# EAGLE design EM4100_cloner-revB (EAGLE 6.5.0)
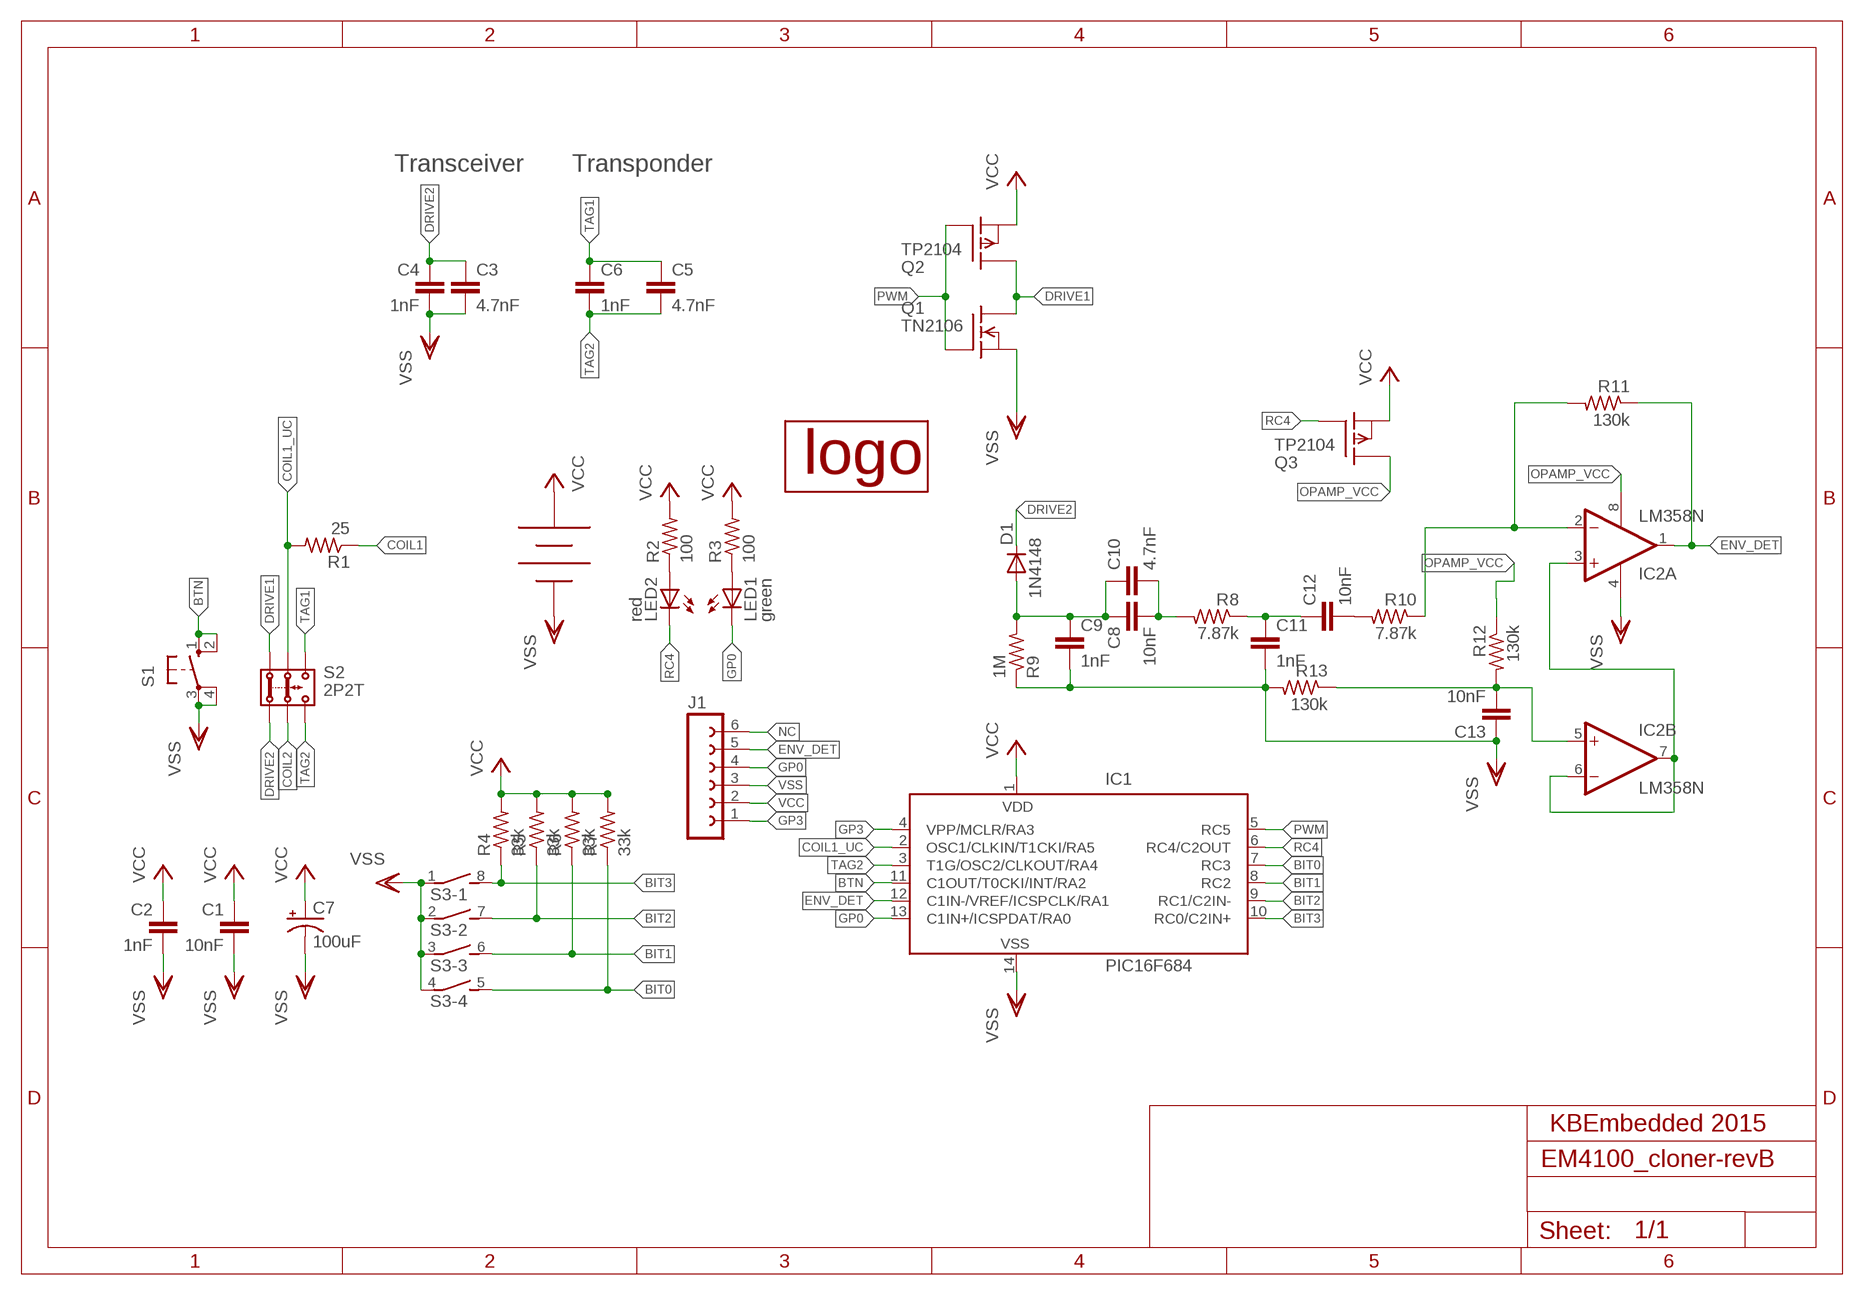
[diagram p0: schematic, sheet 1]

## Parts
BT1  BAT-HLD-001-THM  [BAT-HLD-001-THM]
C1  10nF  C-EU050-024X044  [C050-024X044]
C2  1nF  C-EU050-024X044  [C050-024X044]
C3  4.7nF  C-EU050-024X044  [C050-024X044]
C4  1nF  C-EU050-024X044  [C050-024X044]
C5  4.7nF  C-EU050-024X044  [C050-024X044]
C6  1nF  C-EU050-024X044  [C050-024X044]
C7  100uF  CPOL-USE2,5-6E  [E2,5-6E]
C8  10nF  C-EU050-024X044  [C050-024X044]
C9  1nF  C-EU050-024X044  [C050-024X044]
C10  4.7nF  C-EU050-024X044  [C050-024X044]
C11  1nF  C-EU050-024X044  [C050-024X044]
C12  10nF  C-EU050-024X044  [C050-024X044]
C13  10nF  C-EU050-024X044  [C050-024X044]
D1  1N4148  DIODE-D-5  [D-5]
IC1  PIC16F684  PIC16F636P  [DIL14]
IC2  LM358N  [DIL08]
J1  FE06-1  [FE06]
LED1  green  LED3MM  [LED3MM]
LED2  red  LED3MM  [LED3MM]
Q1  TN2106  TN0602N3  [TO-92]
Q2  TP2104  TP0602N3  [TO-92]
Q3  TP2104  TP0602N3  [TO-92]
R1  25  R-US_0204/7  [0204/7]
R2  100  R-US_0204/7  [0204/7]
R3  100  R-US_0204/7  [0204/7]
R4  33k  R-US_0204/7  [0204/7]
R5  33k  R-US_0204/7  [0204/7]
R6  33k  R-US_0204/7  [0204/7]
R7  33k  R-US_0204/7  [0204/7]
R8  7.87k  R-US_0204/7  [0204/7]
R9  1M  R-US_0204/7  [0204/7]
R10  7.87k  R-US_0204/7  [0204/7]
R11  130k  R-US_0204/7  [0204/7]
R12  130k  R-US_0204/7  [0204/7]
R13  130k  R-US_0204/7  [0204/7]
S1  10-XX  [B3F-10XX]
S2  2P2T  [2P2T]
S3  DIP04S  [DIP04S]
U$1  KBELOGO-SILK  [KBELOGO-SILK]

## Nets
BIT0: IC1.7(RC3) R7.1 S3.5
BIT1: IC1.8(RC2) R6.1 S3.6
BIT2: IC1.9(RC1/C2IN-) R5.1 S3.7
BIT3: IC1.10(RC0/C2IN+) R4.1 S3.8
BTN: IC1.11(C1OUT/T0CKI/INT/RA2) S1.1(S) S1.2(S1)
COIL1: R1.1
COIL1_UC: IC1.2(OSC1/CLKIN/T1CKI/RA5) R1.2 S2.2.1
COIL2: S2.2.2
DRIVE1: Q1.3(D) Q2.3(D) S2.1.1
DRIVE2: C3.1 C4.1 D1.C S2.1.2
ENV_DET: IC1.12(C1IN-/VREF/ICSPCLK/RA1) IC2.1(A:OUT) J1.5 R11.1
GP0: IC1.13(C1IN+/ICSPDAT/RA0) J1.4 LED1.K(C)
GP3: IC1.4(VPP/MCLR/RA3) J1.1
N$1: LED2.A R2.1
N$2: LED1.A R3.1
N$3: C8.1 C9.1 C10.1 D1.A R9.2
N$5: C8.2 C10.2 R8.2
N$6: C11.1 C12.1 R8.1
N$7: C12.2 R10.2
N$8: IC2.3(A:+IN) IC2.6(B:-IN) IC2.7(B:OUT)
N$9: C13.2 IC2.5(B:+IN) R12.2 R13.1
N$10: IC2.2(A:-IN) R10.1 R11.2
NC: J1.6
OPAMP_VCC: IC2.8(P:V+) Q3.3(D) R12.1
PWM: IC1.5(RC5) Q1.2(G) Q2.2(G)
RC4: IC1.6(RC4/C2OUT) LED2.K(C) Q3.2(G)
TAG1: C5.1 C6.1 S2.3.1
TAG2: C5.2 C6.2 IC1.3(T1G/OSC2/CLKOUT/RA4) S2.3.2
VCC: BT1.+@0(VCC) BT1.+@1(VCC) BT1.+@2(VCC) BT1.+@3(VCC) C1.1 C2.1 C7.+ IC1.1(VDD) J1.2 Q2.1(S) Q3.1(S) R2.2 R3.2 R4.2 R5.2 R6.2 R7.2
VSS: BT1.-(VSS) C1.2 C2.2 C3.2 C4.2 C7.- C9.2 C11.2 C13.1 IC1.14(VSS) IC2.4(P:V-) J1.3 Q1.1(S) R9.1 R13.2 S1.3(P) S1.4(P1) S3.1 S3.2 S3.3 S3.4

## Notes on the sheet
- Transceiver | Transponder
- KBEmbedded 2015

## Library data of the parts
BT1 = cuslibrary:BAT-HLD-001-THM
C1-C6 C8-C13 = rcl:C-EU: CAPACITOR, European symbol
C7 = rcl:CPOL-US: POLARIZED CAPACITOR, American symbol
D1 = diode:DIODE-: DIODE
IC1 = cuslibrary:PIC16F636: 14-Pin, Flash-Based 8-Bit CMOS Microcontroller High Performance RISC CPU: * Only 35 instructions to learn - All single-cycle instructions except branches * Operating speed: - DC - 20 MHz oscillator/clock input - DC - 200 ns instruction cycle * Internal and external oscillator options - Precision Internal 4 MHz oscillator factory calibrated to ±1% - External Oscillator support for crystals and resonators - 5?s wake-up from SLEEP, 3.0V, typical * Power saving SLEEP mode * Wide operating voltage range - 2.0V to 5.5V * Industrial and Extended temperature range * Low power Power-on Reset (POR) * Power-up Timer (PWRT) and Oscillator Start-up Timer (OST) * Brown-out Detect (BOD) * Watchdog Timer (WDT) with independent oscillator for reliable operation * Multiplexed MCLR/Input-pin * Interrupt-on-pin change * Individual programmable weak pull-ups * Programmable code protection * High Endurance FLASH/EEPROM Cell - 100,000 write FLASH endurance - 1,000,000 write EEPROM endurance - FLASH/Data EEPROM Retention: > 40 years * Standby Current: - 1 nA @ 2.0V, typical * Operating Current: - 8.5?A @ 32 kHz, 2.0V, typical - 100?A @ 1 MHz, 2.0V, typical * Watchdog Timer Current - 300 nA @ 2.0V, typical * Timer1 oscillator current: - 4?A @ 32 kHz, 2.0V, typical * 12 I/O pins with individual direction control * High current sink/source for direct LED drive * Analog-to-Digital Converter module (PIC16F676): - 10-bit resolution - Programmable 8-channel input - Voltage reference input * In-Circuit Serial ProgrammingTM (ICSPTM) via two pins Source: http://ww1.microchip.com/downloads/en/DeviceDoc/40039E.pdf; MF: MICROCHIP; MPN: PIC16F636-I/P
IC2 = linear:LM358: OP AMP also LM158; LM258; LM2904 Source: http://cache.national.com/ds/LM/LM158.pdf
J1 = con-lsta:FE06-1: FEMALE HEADER; OC_FARNELL: unknown; OC_NEWARK: unknown
LED1 LED2 = led:LED: LED OSRAM: - CHIPLED LG R971, LG N971, LY N971, LG Q971, LY Q971, LO R971, LY R971 LH N974, LH R974 LS Q976, LO Q976, LY Q976 LO Q996 - Hyper CHIPLED LW Q18S LB Q993, LB Q99A, LB R99A - SideLED LS A670, LO A670, LY A670, LG A670, LP A670 LB A673, LV A673, LT A673, LW A673 LH A674 LY A675 LS A676, LA A676, LO A676, LY A676, LW A676 LS A679, LY A679, LG A679 - Hyper Micro SIDELED® LS Y876, LA Y876, LO Y876, LY Y876 LT Y87S - SmartLED LW L88C, LW L88S LB L89C, LB L89S, LG L890 LS L89K, LO L89K, LY L89K LS L896, LA L896, LO L896, LY L896 - TOPLED LS T670, LO T670, LY T670, LG T670, LP T670 LSG T670, LSP T670, LSY T670, LOP T670, LYG T670 LG T671, LOG T671, LSG T671 LB T673, LV T673, LT T673, LW T673 LH T674 LS T676, LA T676, LO T676, LY T676, LB T676, LH T676, LSB T676, LW T676 LB T67C, LV T67C, LT T67C, LS T67K, LO T67K, LY T67K, LW E67C LS E67B, LA E67B, LO E67B, LY E67B, LB E67C, LV E67C, LT E67C LW T67C LS T679, LY T679, LG T679 LS T770, LO T770, LY T770, LG T770, LP T770 LB T773, LV T773, LT T773, LW T773 LH T774 LS E675, LA E675, LY E675, LS T675 LS T776, LA T776, LO T776, LY T776, LB T776 LHGB T686 LT T68C, LB T68C - Hyper Mini TOPLED® LB M676 - Mini TOPLED Santana® LG M470 LS M47K, LO M47K, LY M47K Source: http://www.osram.convergy.de LUXEON: - LUMILED® LXK2-PW12-R00, LXK2-PW12-S00, LXK2-PW14-U00, LXK2-PW14-V00 LXK2-PM12-R00, LXK2-PM12-S00, LXK2-PM14-U00 LXK2-PE12-Q00, LXK2-PE12-R00, LXK2-PE12-S00, LXK2-PE14-T00, LXK2-PE14-U00 LXK2-PB12-K00, LXK2-PB12-L00, LXK2-PB12-M00, LXK2-PB14-N00, LXK2-PB14-P00, LXK2-PB14-Q00 LXK2-PR12-L00, LXK2-PR12-M00, LXK2-PR14-Q00, LXK2-PR14-R00 LXK2-PD12-Q00, LXK2-PD12-R00, LXK2-PD12-S00 LXK2-PH12-R00, LXK2-PH12-S00 LXK2-PL12-P00, LXK2-PL12-Q00, LXK2-PL12-R00 Source: www.luxeon.com KINGBRIGHT: KA-3528ASYC Source: www.kingbright.com
Q1 = transistor-fet:TN0602N3: N-Channel Enhancement MOSFET 20V; 4A; 0,75Ohm
Q2 Q3 = transistor-fet:TP0602N3: P-Channel Enhancement MOSFET -20V; -2A; 2,0Ohm
R1-R13 = rcl:R-US_: RESISTOR, American symbol
S1 = switch-omron:10-XX: OMRON SWITCH; MPN: B3F-1000; OC_FARNELL: 176432; OC_NEWARK: 36M3542
S2 = cuslibrary:2P2T: SLIDE SWITCH 2P2T Part No. SS-22F05-G(A)4 Source: CANAL ELECTRONIC CO., LTD .. switsch.pdf
S3 = switch-dil:DIP04S: DIL/CODE SWITCH; OC_FARNELL: unknown; OC_NEWARK: unknown
U$1 = cuslibrary:KBELOGO-SILK

## Board
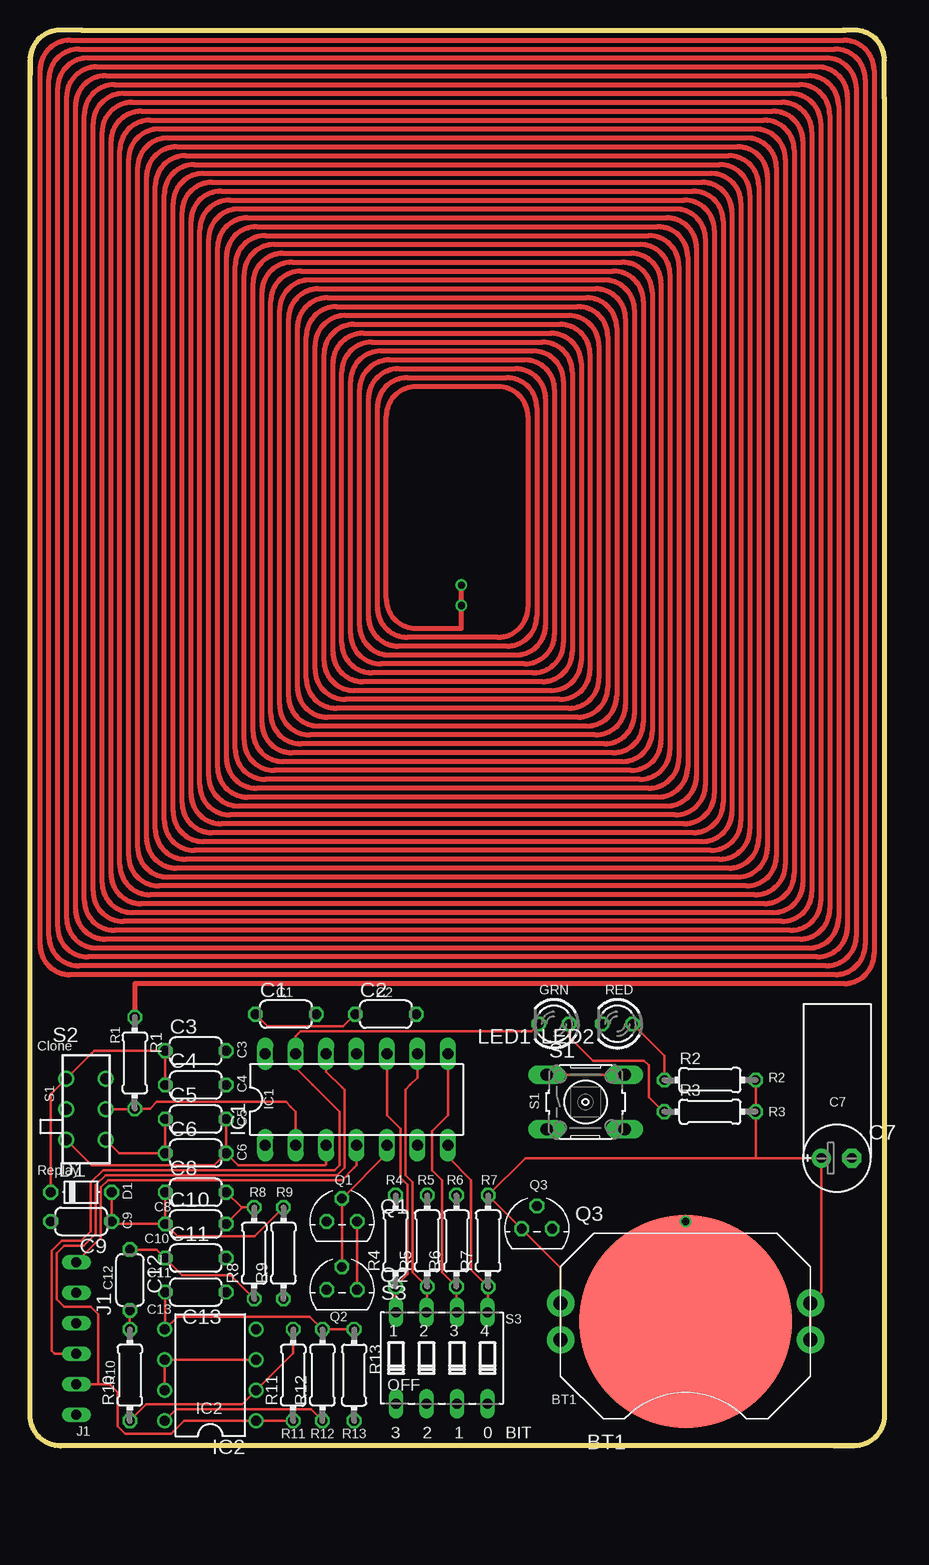
[diagram p1: board, top side]
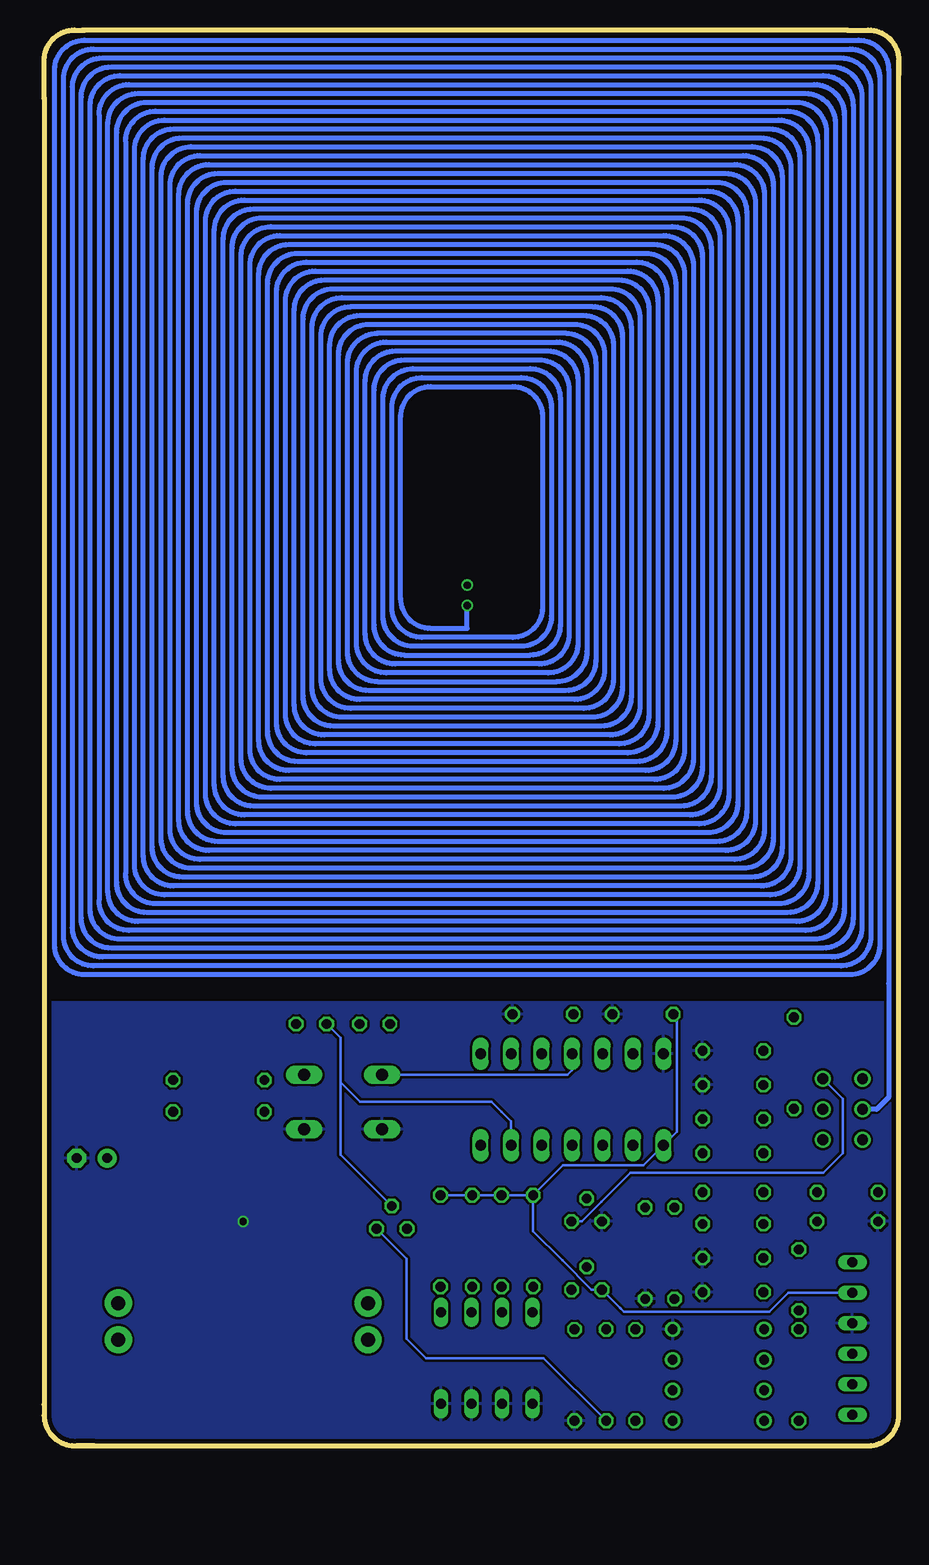
[diagram p2: board, bottom side, seen from below]

Size 71.25 x 117.98 mm. Coordinates in mm from the lower left corner, seen from the top.
Outline: 68.71,0 68.58,0
Outline: 68.58,0 67.06,0
Outline: 67.06,0 2.54,0 arc-90 0,2.54
Outline: 0,2.41 0,114.2
Outline: 0,114.2 0,115.19
Outline: 0,115.19 0,115.44
Outline: 4.27,117.98 4.32,117.98
Outline: 4.32,117.98 67.82,117.98
Outline: 67.82,117.98 68.07,117.98
Outline: 71.25,112.37 71.25,112.27
Outline: 71.25,112.27 71.25,3.45
Outline: 0,115.32 0,115.19
Outline: 0,115.19 0,114.2
Outline: 67.06,0 68.58,0
Outline: 71.25,3.43 71.25,2.54 arc-90 68.71,0
Outline: 68.71,0 68.58,0
Outline: 71.25,112.27 71.25,115.44 arc90 68.71,117.98 67.82,117.98
Outline: 4.32,117.98 2.54,117.98 arc90 0,115.44
Outline: 0,115.44 0,115.19
Copper layers (1*16): Top 0.0356mm / dielectric 1.5011mm / Bottom 0.0356mm
Design rules "RIFD": minimum track width 6mil, minimum drill 13mil, track to track 8mil, track to pad 8mil, pad to pad 8mil, via to via 8mil, smd to smd 8mil, copper to edge 15mil, drill to drill 6mil, minimum pad ring 7mil, minimum via ring 7mil, stop-mask expansion 3mil, vias tented up to drill 0mil, thermal gap 10mil

### Footprints (pad centres in the part's own frame; a part is rotated, then mirrored left to right if it is on the bottom)
BAT-HLD-001-THM = drill 1.168 pad 2.286: +@0 -10.414,1.524; +@1 -10.414,-1.524; +@2 10.414,1.524; +@3 10.414,-1.524 | smd 17.78 x 17.78: - 0,0
C050-024X044 = drill 0.813 octagon: 1 -2.54,0; 2 2.54,0
E2,5-6E = drill 0.813 pad 1.575: + -1.27,0 | drill 0.813 pad 1.575 octagon: - 1.27,0
D-5 = drill 0.813 octagon: A 2.54,0; C -2.54,0
DIL14 = drill 0.9 long: 1 -7.62,-3.81; 2 -5.08,-3.81; 3 -2.54,-3.81; 4 0,-3.81; 5 2.54,-3.81; 6 5.08,-3.81; 7 7.62,-3.81; 8 7.62,3.81; 9 5.08,3.81; 10 2.54,3.81; 11 0,3.81; 12 -2.54,3.81; 13 -5.08,3.81; 14 -7.62,3.81
DIL08 = drill 0.813 pad 1.27: 1 -3.81,-3.81; 2 -1.27,-3.81; 3 1.27,-3.81; 4 3.81,-3.81; 5 3.81,3.81; 6 1.27,3.81; 7 -1.27,3.81; 8 -3.81,3.81
FE06 = drill 0.813 long: 1 -6.35,0; 2 -3.81,0; 3 -1.27,0; 4 1.27,0; 5 3.81,0; 6 6.35,0
LED3MM = drill 0.813 octagon: A -1.27,0; K 1.27,0
TO-92 = drill 0.813 octagon: 1 -1.27,0; 2 0,1.905; 3 1.27,0
0204/7 = drill 0.813 octagon: 1 -3.81,0; 2 3.81,0
B3F-10XX = drill 1.016 long: 1 -3.251,2.261; 2 3.251,2.261; 3 -3.251,-2.261; 4 3.251,-2.261
2P2T = drill 0.9: 1.1 -2.54,1.651; 1.2 -2.54,-1.651; 2.1 0,1.651; 2.2 0,-1.651; 3.1 2.54,1.651; 3.2 2.54,-1.651
DIP04S = drill 0.813 long: 1 -3.81,-3.81; 2 -1.27,-3.81; 3 1.27,-3.81; 4 3.81,-3.81; 5 3.81,3.81; 6 1.27,3.81; 7 -1.27,3.81; 8 -3.81,3.81

### Placement (x,y rotation side)
BT1  54.66,10.36 0 top
C1  21.34,35.97 0 top
C2  29.67,35.97 0 top
C3  13.82,32.92 0 top
C4  13.82,30.07 0 top
C5  13.82,27.23 0 top
C6  13.82,24.38 0 top
C7  67.26,23.98 0 top
C8  13.82,21.13 0 top
C9  4.27,18.69 180 top
C10  13.82,18.49 0 top
C11  13.82,15.65 0 top
C12  8.33,13.82 270 top
C13  13.82,12.8 180 top
D1  4.27,21.13 0 top
IC1  27.23,28.85 0 top
IC2  15.04,5.89 90 top
J1  3.86,8.94 270 top
LED1  43.69,35.15 180 top
LED2  48.97,35.15 180 top
Q1  26.01,18.69 0 top
Q2  26.01,13 0 top
Q3  42.27,18.08 0 top
R1  8.74,31.9 270 top
R2  56.69,30.48 0 top
R3  56.69,27.84 0 top
R4  30.48,17.07 90 top
R5  33.12,17.07 90 top
R6  35.56,17.07 90 top
R7  38.2,17.07 90 top
R8  18.69,16.05 90 top
R9  21.13,16.05 90 top
R10  8.33,5.89 90 top
R11  21.95,5.89 90 top
R12  24.38,5.89 90 top
R13  27.03,5.89 270 top
S1  46.33,28.65 0 top
S2  4.67,28.04 270 top
S3  34.34,7.32 0 top
U$1  31.29,109.12 0 top
U$2  DN_LOGO  [DN_LOGO]  29.39,75.5 0 top

### Tracks (layer width: path | path; a pad name or v marks a point on that pad's centre or on a via)
1_50
  Bottom 0.203: 47.9,97.15 | 24.06,59.23 24.06,59.24 | 52.34,101.59 | 56.78,106.03 | 54.56,103.81 | 50.12,99.37 | 21.84,57.02 | 59,108.25 | 63.44,112.69 | 9.26,44.44 9.26,44.43 | 67.88,117.13 | 4.82,39.99 4.82,40 | 65.66,114.91 | 7.04,42.22 7.04,42.21 | 68.89,43.23 68.9,43.23 | 66.67,45.45 66.68,45.45 | 61.22,110.47 | 64.45,47.67 64.46,47.67 | 51.88,60.26 51.87,60.26 | 49.66,62.48 49.65,62.48 | 45.68,94.93 | 26.28,61.45 26.28,61.46 | 43.46,92.71 | 28.5,63.68 28.5,63.67 | 47.44,64.69 47.43,64.69 | 41.24,90.49 | 30.72,65.89 30.72,65.9 | 45.22,66.92 | 43,69.14 42.99,69.14 | 46.42,95.67 | 22.3,93.17 | 48.64,97.89 | 20.08,95.39 | 14.9,100.58 | 16.38,99.09 | 51.6,100.86 | 17.12,98.36 | 11.94,103.53 | 55.3,104.55 | 13.42,102.05 | 14.16,101.31 | 14.44,49.62 | 17.4,52.58 | 20.36,55.53 | 8.98,106.49 | 59.74,108.99 | 11.2,104.27 | 57.52,106.77 | 5.28,110.19 | 6.02,109.45 | 62.7,111.95 | 3.8,111.67 | 3.06,112.41 | 6.3,41.48 | 8.24,107.23 | 62.98,49.15 | 60.02,52.12 | 23.04,92.44 | 25.54,60.72 | 48.92,63.22 | 44.2,93.45 | 24.52,90.95 | 25.26,90.22 | 27.48,88
  Bottom 0.4: 49.65,62.48 arc-90 47.16,59.97 24.8,59.97 arc-90 22.3,62.48 22.3,93.17 arc-90 24.8,95.67 46.42,95.67 arc-90 48.92,93.17 48.92,63.22 arc-90 46.42,60.72 25.54,60.72 arc-90 23.04,63.22 23.04,92.44 arc-90 25.54,94.93 45.68,94.93 | 51.87,60.26 arc-90 49.38,57.75 22.58,57.75 arc-90 20.08,60.26 20.08,95.39 arc-90 22.58,97.89 48.64,97.89 arc-90 51.14,95.39 51.14,60.99 arc-90 48.64,58.49 23.32,58.49 arc-90 20.82,60.99 20.82,94.66 arc-90 23.32,97.15 47.9,97.15 | 24.06,59.23 47.9,59.23 arc90 50.4,61.73 50.4,94.66 arc90 47.9,97.15 | 49.66,62.48 49.66,93.91 arc90 47.16,96.42 24.06,96.42 arc90 21.56,93.91 21.56,61.73 arc90 24.06,59.24 | 52.34,101.59 18.88,101.59 arc90 16.38,99.09 16.38,56.55 arc90 18.88,54.05 53.08,54.05 arc90 55.58,56.55 55.58,99.83 arc90 53.08,102.33 18.14,102.33 arc90 15.64,99.83 15.64,55.81 arc90 18.14,53.31 53.82,53.31 arc90 56.32,55.81 56.32,100.58 arc90 53.82,103.08 17.4,103.08 arc90 14.9,100.58 14.9,55.07 arc90 17.4,52.58 54.56,52.58 arc90 57.06,55.07 57.06,101.31 arc90 54.56,103.81 | 52.34,101.59 arc-90 54.84,99.09 54.84,57.29 arc-90 52.34,54.8 19.62,54.8 arc-90 17.12,57.29 17.12,98.36 arc-90 19.62,100.86 51.6,100.86 arc-90 54.1,98.36 54.1,58.03 arc-90 51.6,55.53 20.36,55.53 arc-90 17.86,58.03 17.86,97.61 arc-90 20.36,100.11 50.86,100.11 arc-90 53.36,97.61 53.36,58.77 arc-90 50.86,56.27 21.1,56.27 arc-90 18.6,58.77 18.6,96.88 arc-90 21.1,99.37 50.12,99.37 | 56.78,106.03 14.44,106.03 arc90 11.94,103.53 11.94,52.12 arc90 14.44,49.62 57.52,49.62 arc90 60.02,52.12 60.02,104.27 arc90 57.52,106.77 13.7,106.77 arc90 11.2,104.27 11.2,51.37 arc90 13.7,48.87 58.26,48.87 arc90 60.76,51.37 60.76,105.02 arc90 58.26,107.52 12.96,107.52 arc90 10.46,105.02 10.46,50.63 arc90 12.96,48.13 59,48.13 arc90 61.5,50.63 61.5,105.75 arc90 59,108.25
  Bottom 0.4: 56.78,106.03 arc-90 59.28,103.53 59.28,52.85 arc-90 56.78,50.35 15.18,50.35 arc-90 12.68,52.85 12.68,102.8 arc-90 15.18,105.3 56.04,105.3 arc-90 58.54,102.8 58.54,53.59 arc-90 56.04,51.09 15.92,51.09 arc-90 13.42,53.59 13.42,102.05 arc-90 15.92,104.55 55.3,104.55 arc-90 57.8,102.05 57.8,54.34 arc-90 55.3,51.84 16.66,51.84 arc-90 14.16,54.34 14.16,101.31 arc-90 16.66,103.81 54.56,103.81 | 21.84,57.02 50.12,57.02 arc90 52.62,59.51 52.62,96.88 arc90 50.12,99.37 | 51.88,60.26 51.88,96.13 arc90 49.38,98.64 21.84,98.64 arc90 19.34,96.13 19.34,59.51 arc90 21.84,57.02 | 59,108.25 12.22,108.25 arc90 9.72,105.75 9.72,49.9 arc90 12.22,47.4 59.74,47.4 arc90 62.24,49.9 62.24,106.49 arc90 59.74,108.99 11.48,108.99 arc90 8.98,106.49 8.98,49.15 arc90 11.48,46.65 60.48,46.65 arc90 62.98,49.15 62.98,107.23 arc90 60.48,109.73 10.74,109.73 arc90 8.24,107.23 8.24,48.41 arc90 10.74,45.91 61.22,45.91 arc90 63.72,48.41 63.72,107.97 arc90 61.22,110.47 | 63.44,112.69 7.78,112.69 arc90 5.28,110.19 5.28,45.45 arc90 7.78,42.95 64.18,42.95 arc90 66.67,45.45 | 63.44,112.69 arc-90 65.94,110.19 65.94,46.19 arc-90 63.44,43.7 8.52,43.7 arc-90 6.02,46.19 6.02,109.45 arc-90 8.52,111.95 62.7,111.95 arc-90 65.2,109.45 65.2,46.93 arc-90 62.7,44.43 9.26,44.43 | 64.46,47.67 64.46,108.71 arc90 61.96,111.21 9.26,111.21 arc90 6.76,108.71 6.76,46.93 arc90 9.26,44.44 | 68.9,43.23 68.9,113.15 arc90 66.4,115.66 4.82,115.66 arc90 2.32,113.15 2.32,42.49 arc90 4.82,40 | 67.88,117.13 3.34,117.13 arc90 0.84,114.63 | 4.82,39.99 67.14,39.99 arc90 69.64,42.49 69.64,113.89 arc90 67.14,116.39 4.08,116.39 arc90 1.58,113.89 1.58,41.75 arc90 4.08,39.26 67.88,39.26 arc90 70.38,41.75 70.38,114.63 arc90 67.88,117.13
  Bottom 0.4: 7.04,42.21 64.92,42.21 arc90 67.42,44.71 67.42,111.67 arc90 64.92,114.17 6.3,114.17 arc90 3.8,111.67 3.8,43.97 arc90 6.3,41.48 65.66,41.48 arc90 68.16,43.97 68.16,112.41 arc90 65.66,114.91 | 68.89,43.23 arc-90 66.4,40.73 5.56,40.73 arc-90 3.06,43.23 3.06,112.41 arc-90 5.56,114.91 65.66,114.91 | 66.68,45.45 66.68,110.93 arc90 64.18,113.44 7.04,113.44 arc90 4.54,110.93 4.54,44.71 arc90 7.04,42.22 | 61.22,110.47 10,110.47 arc90 7.5,107.97 7.5,47.67 arc90 10,45.17 61.96,45.17 arc90 64.45,47.67 | 26.28,61.45 45.68,61.45 arc90 48.18,63.95 48.18,92.44 arc90 45.68,94.93 | 47.44,64.69 47.44,91.69 arc90 44.94,94.19 26.28,94.19 arc90 23.78,91.69 23.78,63.95 arc90 26.28,61.46 | 47.43,64.69 arc-90 44.94,62.19 27.02,62.19 arc-90 24.52,64.69 24.52,90.95 arc-90 27.02,93.45 44.2,93.45 arc-90 46.7,90.95 46.7,65.44 arc-90 44.2,62.94 27.76,62.94 arc-90 25.26,65.44 25.26,90.22 arc-90 27.76,92.71 43.46,92.71 | 43.46,92.71 arc-90 45.96,90.22 45.96,66.17 arc-90 43.46,63.67 28.5,63.67 | 45.22,66.92 45.22,89.47 arc90 42.72,91.97 28.5,91.97 arc90 26,89.47 26,66.17 arc90 28.5,63.68 | 45.22,66.92 arc-90 42.72,64.41 29.24,64.41 arc-90 26.74,66.92 26.74,88.73 arc-90 29.24,91.23 41.98,91.23 arc-90 44.48,88.73 44.48,67.66 arc-90 41.98,65.16 29.98,65.16 arc-90 27.48,67.66 27.48,88 arc-90 29.98,90.49 41.24,90.49 | 41.24,90.49 arc-90 43.74,88 43.74,68.39 arc-90 41.24,65.89 30.72,65.89 | 43,69.14 43,87.25 arc90 40.5,89.75 30.72,89.75 arc90 28.22,87.25 28.22,68.39 arc90 30.72,65.9 | 39.02,88.27 32.2,88.27 arc90 29.7,85.78 29.7,69.88 arc90 32.2,67.38 39.76,67.38 arc90 42.26,69.88 42.26,86.51 arc90 39.76,89.01 31.46,89.01 arc90 28.96,86.51 28.96,69.14 arc90 31.46,66.63 40.5,66.63 arc90 42.99,69.14
1_57  (via drill 0.6)
  Top 0.4: 39.02,88.27 32.2,88.27 arc90 29.7,85.78 29.7,70.61 arc90 32.2,68.11 35.98,68.11 v35.98,70.02 35.98,71.72
  Bottom 0.4: v35.98,70.02 35.98,68.11 39.02,68.11 arc90 41.52,70.61 41.52,85.78 arc90 39.02,88.27
BIT0
  Top 0.203: S3.5 38.2,11.18 R7.1 36.78,14.68 36.78,22.15 34.85,24.08 IC1.7
BIT1
  Top 0.203: S3.6 35.56,11.18 R6.1 34.34,14.48 34.34,22.15 33.53,22.96 33.53,26.21 34.85,27.53 IC1.8
BIT2
  Top 0.203: S3.7 33.12,11.18 R5.1 31.9,14.48 31.9,21.95 31.29,22.55 31.29,22.76 31.29,29.67 31.7,30.07 32.31,30.68 IC1.9
BIT3
  Top 0.203: S3.8 30.48,11.18 R4.1 31.5,14.28 31.5,21.74 30.89,22.35 30.89,26.42 29.77,27.53 IC1.10
BTN
  Top 0.203: S1.2 S1.1
  Bottom 0.203: S1.1 27.61,30.91 27.23,31.29 IC1.11
COIL1
  Top 0.203: 67.88,117.13 | 61.22,110.47 | 63.44,112.69 | 65.66,114.91 | 59,108.25 | 50.12,99.37 | 52.34,101.59 | 56.78,106.03 | 54.56,103.81 | 47.9,97.15 | 51.14,60.26 51.13,60.26 | 45.68,94.93 | 48.92,62.48 48.91,62.48 | 43.46,92.71 | 46.7,64.69 | 41.24,90.49 | 44.48,66.92 | 42.26,69.14 | 3.8,111.67 | 5.28,110.19 | 6.02,109.45 | 62.7,111.95 | 3.06,112.41 | 5.56,41.48 | 8.52,44.43 | 0.84,114.63 | 8.24,107.23 | 8.98,106.49 | 59.74,108.99 | 51.6,100.86 | 14.9,100.58 | 16.38,99.09 | 17.12,98.36 | 11.94,103.53 | 55.3,104.55 | 13.42,102.05 | 14.16,101.31 | 11.2,104.27 | 57.52,106.77 | 13.7,49.62 | 16.66,52.58 | 19.62,55.53 | 60.02,51.37 | 62.98,48.41 | 48.64,97.89 | 20.08,95.39 | 51.88,59.51 | 23.04,92.44 | 46.42,95.67 | 22.3,93.17 | 24.8,60.72 | 44.2,93.45 | 24.52,90.95 | 25.26,90.22 | 27.76,63.67 | 27.48,88
  Top 0.4: 67.88,117.13 arc-90 70.38,114.63 70.38,41.02 arc-90 67.88,38.51 9.22,38.51 8.74,38.51 8.74,36.37 | 67.88,117.13 3.34,117.13 arc90 0.84,114.63 0.84,41.75 arc90 3.34,39.26 67.14,39.26 arc90 69.64,41.75 69.64,113.89 arc90 67.14,116.39 4.08,116.39 arc90 1.58,113.89 1.58,42.49 arc90 4.08,39.99 66.4,39.99 arc90 68.9,42.49 68.9,113.15 arc90 66.4,115.66 4.82,115.66 arc90 2.32,113.15 2.32,43.23 arc90 4.82,40.73 65.66,40.73 arc90 68.16,43.23 68.16,112.41 arc90 65.66,114.91 | 61.22,110.47 arc-90 63.72,107.97 63.72,47.67 arc-90 61.22,45.17 9.26,45.17 arc-90 6.76,47.67 6.76,108.71 arc-90 9.26,111.21 61.96,111.21 arc-90 64.46,108.71 64.46,46.93 arc-90 61.96,44.43 8.52,44.43 arc-90 6.02,46.93 6.02,109.45 arc-90 8.52,111.95 62.7,111.95 arc-90 65.2,109.45 65.2,46.19 arc-90 62.7,43.7 7.78,43.7 arc-90 5.28,46.19 5.28,110.19 arc-90 7.78,112.69 63.44,112.69 | 61.22,110.47 10,110.47 arc90 7.5,107.97 7.5,48.41 arc90 10,45.91 60.48,45.91 arc90 62.98,48.41 62.98,107.23 arc90 60.48,109.73 10.74,109.73 arc90 8.24,107.23 8.24,49.15 arc90 10.74,46.65 59.74,46.65 arc90 62.24,49.15 62.24,106.49 arc90 59.74,108.99 11.48,108.99 arc90 8.98,106.49 8.98,49.9 arc90 11.48,47.4 59,47.4 arc90 61.5,49.9 61.5,105.75 arc90 59,108.25 | 63.44,112.69 arc-90 65.94,110.19 65.94,45.45 arc-90 63.44,42.95 7.04,42.95 arc-90 4.54,45.45 4.54,110.93 arc-90 7.04,113.44 64.18,113.44 arc-90 66.68,110.93 66.68,44.71 arc-90 64.18,42.21 6.3,42.21 arc-90 3.8,44.71 3.8,111.67 arc-90 6.3,114.17 64.92,114.17 arc-90 67.42,111.67 67.42,43.97 arc-90 64.92,41.48 5.56,41.48 arc-90 3.06,43.97 3.06,112.41 arc-90 5.56,114.91 65.66,114.91
  Top 0.4: 59,108.25 12.22,108.25 arc90 9.72,105.75 9.72,50.63 arc90 12.22,48.13 58.26,48.13 arc90 60.76,50.63 60.76,105.02 arc90 58.26,107.52 12.96,107.52 arc90 10.46,105.02 10.46,51.37 arc90 12.96,48.87 57.52,48.87 arc90 60.02,51.37 60.02,104.27 arc90 57.52,106.77 13.7,106.77 arc90 11.2,104.27 11.2,52.12 arc90 13.7,49.62 56.78,49.62 arc90 59.28,52.12 59.28,103.53 arc90 56.78,106.03 | 50.12,99.37 arc-90 52.62,96.88 52.62,58.77 arc-90 50.12,56.27 20.36,56.27 arc-90 17.86,58.77 17.86,97.61 arc-90 20.36,100.11 50.86,100.11 arc-90 53.36,97.61 53.36,58.03 arc-90 50.86,55.53 19.62,55.53 arc-90 17.12,58.03 17.12,98.36 arc-90 19.62,100.86 51.6,100.86 arc-90 54.1,98.36 54.1,57.29 arc-90 51.6,54.8 18.88,54.8 arc-90 16.38,57.29 16.38,99.09 arc-90 18.88,101.59 52.34,101.59 | 50.12,99.37 21.1,99.37 arc90 18.6,96.88 18.6,59.51 arc90 21.1,57.02 49.38,57.02 arc90 51.88,59.51 51.88,96.13 arc90 49.38,98.64 21.84,98.64 arc90 19.34,96.13 19.34,60.26 arc90 21.84,57.75 48.64,57.75 arc90 51.13,60.26 | 52.34,101.59 arc-90 54.84,99.09 54.84,56.55 arc-90 52.34,54.05 18.14,54.05 arc-90 15.64,56.55 15.64,99.83 arc-90 18.14,102.33 53.08,102.33 arc-90 55.58,99.83 55.58,55.81 arc-90 53.08,53.31 17.4,53.31 arc-90 14.9,55.81 14.9,100.58 arc-90 17.4,103.08 53.82,103.08 arc-90 56.32,100.58 56.32,55.07 arc-90 53.82,52.58 16.66,52.58 arc-90 14.16,55.07 14.16,101.31 arc-90 16.66,103.81 54.56,103.81 | 56.78,106.03 14.44,106.03 arc90 11.94,103.53 11.94,52.85 arc90 14.44,50.35 56.04,50.35 arc90 58.54,52.85 58.54,102.8 arc90 56.04,105.3 15.18,105.3 arc90 12.68,102.8 12.68,53.59 arc90 15.18,51.09 55.3,51.09 arc90 57.8,53.59 57.8,102.05 arc90 55.3,104.55 15.92,104.55 arc90 13.42,102.05 13.42,54.34 arc90 15.92,51.84 54.56,51.84 arc90 57.06,54.34 57.06,101.31 arc90 54.56,103.81
  Top 0.4: 47.9,97.15 arc-90 50.4,94.66 50.4,60.99 arc-90 47.9,58.49 22.58,58.49 arc-90 20.08,60.99 20.08,95.39 arc-90 22.58,97.89 48.64,97.89 arc-90 51.14,95.39 51.14,60.26 | 47.9,97.15 23.32,97.15 arc90 20.82,94.66 20.82,61.73 arc90 23.32,59.23 47.16,59.23 arc90 49.66,61.73 49.66,93.91 arc90 47.16,96.42 24.06,96.42 arc90 21.56,93.91 21.56,62.48 arc90 24.06,59.97 46.42,59.97 arc90 48.91,62.48 | 45.68,94.93 arc-90 48.18,92.44 48.18,63.22 arc-90 45.68,60.72 24.8,60.72 arc-90 22.3,63.22 22.3,93.17 arc-90 24.8,95.67 46.42,95.67 arc-90 48.92,93.17 48.92,62.48 | 45.68,94.93 25.54,94.93 arc90 23.04,92.44 23.04,63.95 arc90 25.54,61.45 44.94,61.45 arc90 47.44,63.95 47.44,91.69 arc90 44.94,94.19 26.28,94.19 arc90 23.78,91.69 23.78,64.69 arc90 26.28,62.19 44.2,62.19 arc90 46.7,64.69 | 44.48,66.92 arc-90 41.98,64.41 28.5,64.41 arc-90 26,66.92 26,89.47 arc-90 28.5,91.97 42.72,91.97 arc-90 45.22,89.47 45.22,66.17 arc-90 42.72,63.67 27.76,63.67 arc-90 25.26,66.17 25.26,90.22 arc-90 27.76,92.71 43.46,92.71 | 43.46,92.71 arc-90 45.96,90.22 45.96,65.44 arc-90 43.46,62.94 27.02,62.94 arc-90 24.52,65.44 24.52,90.95 arc-90 27.02,93.45 44.2,93.45 arc-90 46.7,90.95 46.7,64.69 | 44.48,66.92 44.48,88.73 arc90 41.98,91.23 29.24,91.23 arc90 26.74,88.73 26.74,67.66 arc90 29.24,65.16 41.24,65.16 arc90 43.74,67.66 43.74,88 arc90 41.24,90.49 | 41.24,90.49 29.98,90.49 arc90 27.48,88 27.48,68.39 arc90 29.98,65.89 40.5,65.89 arc90 43,68.39 43,87.25 arc90 40.5,89.75 30.72,89.75 arc90 28.22,87.25 28.22,69.14 arc90 30.72,66.63 39.76,66.63 arc90 42.26,69.14
  Top 0.4: 42.26,69.14 42.26,86.51 arc90 39.76,89.01 31.46,89.01 arc90 28.96,86.51 28.96,69.88 arc90 31.46,67.38 39.02,67.38 arc90 41.52,69.88 41.52,85.78 arc90 39.02,88.27
  Top 0.406: 8.74,36.37 R1.1
COIL1_UC
  Top 0.203: S2.2.1 8.69,28.04 arc90 R1.2 10.01,28.09 10.57,28.65 21.34,28.65 21.74,28.25 22.15,27.84 IC1.2
COIL2
  Bottom 0.4: 0.84,38.51 0.84,29.03 1.22,28.65 1.83,28.04 S2.2.2
DRIVE1
  Top 0.203: Q2.3 Q1.3
  Bottom 0.203: Q1.3 26.42,18.69 24.79,20.32 22.35,22.76 6.3,22.76 4.67,24.38 4.67,28.25 4.67,28.93 S2.1.1
DRIVE2
  Top 0.203: C4.1 C3.1 5.36,32.92 5.16,32.72 S2.1.2 1.83,29.39 1.73,29.29 D1.C
ENV_DET
  Top 0.203: R11.1 IC2.1 12.85,2.08 11.99,1.22 11.79,1.02 7.92,1.02 7.32,1.63 7.32,4.47 6.91,4.88 6.66,5.13 5.69,5.13 | 5.69,5.13 J1.5 | IC1.12 24.69,31.19 26.01,29.87 26.21,29.67 26.21,23.16 25.6,22.55 21.13,22.55 6.3,22.55 5.49,21.74 5.49,17.68 4.47,16.66 2.85,16.66 2.23,16.05 2.23,12.19 2.85,11.58 5.08,11.58 5.69,10.97 5.69,5.13
GP0
  Top 0.203: J1.4 2.08,7.67 2.03,7.72 1.83,7.92 1.83,16.26 2.64,17.07 4.27,17.07 5.08,17.88 5.08,21.95 6.1,22.96 21.13,22.96 25.4,22.96 25.81,23.37 25.81,26.42 25.81,27.84 23.57,30.07 22.15,31.5 IC1.13 22.15,34.14 22.35,34.34 22.55,34.54 30.68,34.54 41.81,34.54 LED1.K
GP3
  Top 0.203: J1.1 5.89,17.32 5.89,21.54 6.5,22.15 9.55,22.15 26.01,22.15 27.03,23.16 27.23,23.37 IC1.4
N$1
  Top 0.203: LED2.A 52.88,32.51 R2.1
N$2
  Top 0.203: R3.1 52.83,27.84 51.61,29.06 51.61,31.7 51.21,32.11 46.94,32.11 44.96,34.09 LED1.A
N$3
  Top 0.203: R9.2 18.75,17.48 16.05,17.48 12.29,17.48 C10.1 | C10.1 7.01,18.49 C9.1 D1.A | C8.1 C10.1
N$4
  Bottom 0.4: 0.84,114.63 0.84,38.53
N$5
  Top 0.203: C8.2 17.63,19.86 18.09,19.86 | 18.09,19.86 R8.2 | C10.2 17.73,19.86 18.09,19.86
N$6
  Top 0.203: C12.1 10.57,16.36 C11.1 12.7,14.22 15.04,14.22 16.71,14.22 R8.1
N$7
  Top 0.203: C12.2 R10.2
N$8
  Top 0.203: IC2.7 IC2.6 IC2.3
N$9
  Top 0.203: C13.2 11.28,9.75 | 11.28,9.75 IC2.5 | 11.28,9.75 12.29,10.77 18.69,10.77 23.32,10.77 R12.2 R13.1
N$10
  Top 0.203: R10.1 9.7,3.45 16.46,3.45 17.68,3.45 IC2.2 21.95,7.72 R11.2
N$161  (via drill 0.6)
  other vias: 35.98,71.72
OPAMP_VCC
  Top 0.203: IC2.8 12.19,3.05 19.3,3.05 23.42,3.05 R12.1
  Bottom 0.203: R12.1 29.62,7.32 33.33,7.32 39.42,7.32 41.05,8.94 41.05,15.6 Q3.3
PWM
  Top 0.203: Q2.2 Q1.2 29.77,24.36 IC1.5
RC4
  Bottom 0.203: IC1.6 32.31,27.03 33.12,27.84 33.93,28.65 44.91,28.65 46.53,30.28 46.53,30.68 | 46.53,30.68 46.53,32.72 46.53,33.98 LED2.K | Q3.2 46.53,24.26 46.53,30.68
TAG1
  Top 0.203: C5.1 C6.1 7.44,24.38 S2.3.1
TAG2
  Top 0.203: C5.2 C6.2 | S2.3.2 5.16,23.37 10.16,23.37 15.34,23.37 C6.2 | C6.2 17.37,23.37 23.37,23.37 24.59,23.37 24.69,23.47 IC1.3
VCC
  Top 0.203: C2.1 26.11,34.95 23.57,34.95 19.81,34.95 C1.1 | R2.2 R3.2 60.5,24.03 60.55,23.98 | 60.55,23.98 C7.+ 65.99,15.24 65.99,12.8 BT1.+@2 BT1.+@3 | 60.55,23.98 41.3,23.98 R7.2 Q3.1 | 41.02,18.06 42.52,16.56 44.25,14.83 BT1.+@0 BT1.+@1 | 41.02,18.06 Q3.1 | Q3.1 41.02,18.09 41.02,18.06
  Bottom 0.203: C1.1 18.49,35.66 18.49,34.14 18.49,26.16 IC1.1 21.29,23.37 22.15,23.37 27.99,23.37 R4.2 | R4.2 30.48,17.88 28.04,15.44 25.6,13.01 Q2.1 23.24,11.51 | R4.2 R5.2 R6.2 R7.2 | 23.24,11.51 22.91,11.18 21.74,11.18 10.77,11.18 9.2,12.75 J1.2 | 23.16,11.43 23.24,11.51
VSS  (via drill 0.6)
  Top 0.203: v54.66,18.69 BT1.-
  pour Bottom: 0,36.98 0,2.54 arc90 2.54,0 68.78,0 arc90 71.32,2.54 71.32,5.49 71.32,36.98
(copper drawn outside any net)
  shapes: Bottom circle x1, Top circle x3

### Text on the board
tPlace: GRN | RED | C1 | C2 | R1 | Clone | C3 | R2 | S1 | C4 | IC1 | S1 | C7 | C5 | R3 | C6 | Replay | Q1 | R4 | R5 | R6 | R7 | D1 | R8 | R9 | Q3 | C8 | C9 | C10 | C11 | C12 | C13 | Q2 | S3 | R10 | IC2 | BT1 | J1 | R11 | R12 | R13 | 3 | 2 | 1 | 0 | BIT
tNames: www.KBEmbedded.com | RFID Cloner / Rev P2
tTest: www.KBEmbedded.com | EM4100 Cloner / Rev. B
bTest: 1 | 0 | 3 | 2 | 5 | 4 | 7 | 6 | 9 | 8 | B | A | D | C | F | E | No touchy zone! | No touchy zone! | No touchy zone! | Capacitively sensitive signals / Body Capacitance can affect operation